# Altium project BRD4210C.PrjPcb
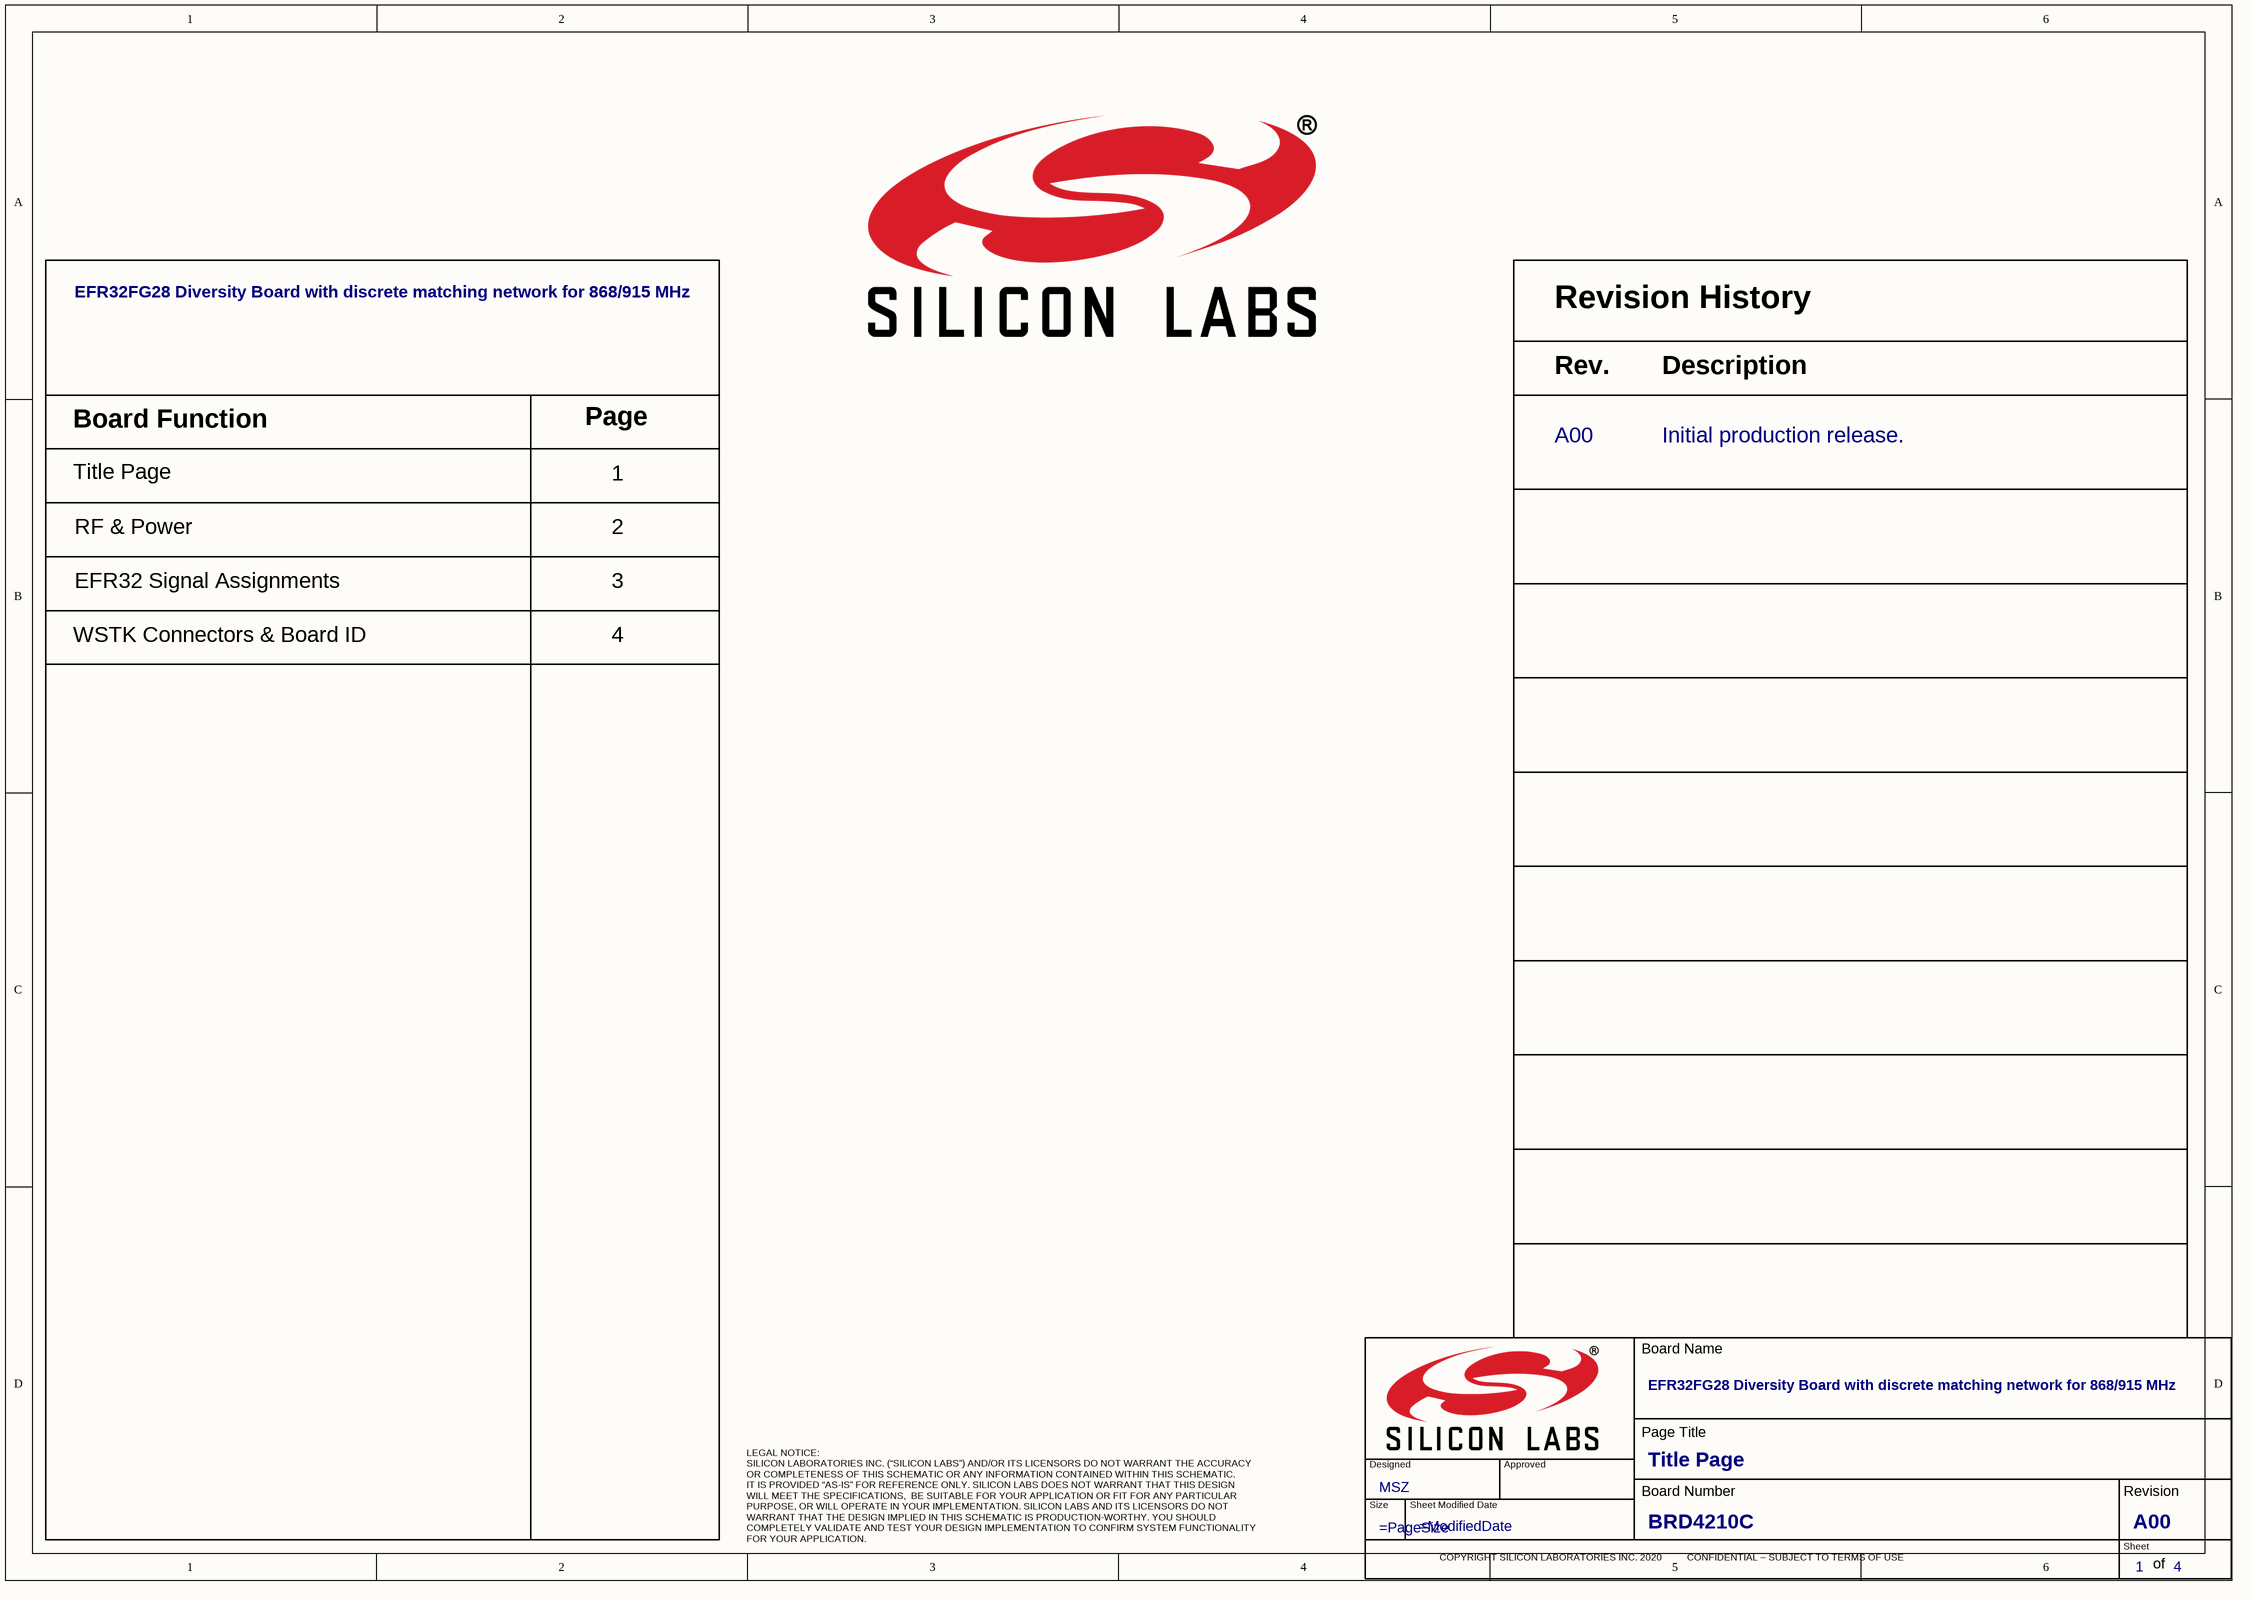
[diagram p0: 01_ Title Page.SchDoc]
4 sheets, 104 parts. Net scope: global (net labels, ports and power ports of the same name join across sheets).
Board file: PCB4210B_A00.PcbDoc
Sheets:
  01_ Title Page.SchDoc
  02_ RF & Power.SchDoc
  03_ EFR32 Signal Assignments.SchDoc
  04_ WSTK Connectors & Board ID.SchDoc

## Sheet 01_ Title Page.SchDoc: EFR32FG28 Diversity Board with discrete matching network for 868/915 MHz
size 420 x 297 mm; Rev3: 3; Dscr4A: g; Dscr8A: o; Dscr6A: k; Board Designer: MSZ; Dscr9A: q; RevCode: A00; Rev1: A00; Dscr3A: e; Header A: EFR32FG28 Diversity Board with discrete matching network for 868/915 MHz; Dscr9B: r; Rev8: 8; Rev5: 5; Page Number: 1; Page Size: A3; Rev6: 6; Page Count: 4; Rev9: 9; Dscr1A: Initial production release.; Doc: BRD4210C; OrgName: Silicon Labs; Dscr5B: j; Dscr7B: n; Rev7: 7; Dscr6B: l; Dscr2A: Updated U1 OPN.; Dscr7A: m; Rev4: 4; Dscr4B: h; Rev2: A00; Dscr3B: f; Dscr1B: b; Dscr8B: p; Page Title: Title Page; Dscr5A: i; Dscr2B: d; DsnPath: C:\Users\maszvobo\Downloads\BRD4210A-A01-schematic-dsn\BRD4210A.DSN; SchematicName: SCHEMATIC1; PageName: 01: Title Page; PageSize: A3; TopSchematic: True

### Parts
(Parts that share a designator on the sheet are numbered #1, #2 ... from top to bottom, then left to right.)
*#1  Header A: EFR32FG28 Diversity Board with discrete matching network for 868/915 MHz  (graphical)
*#2  Dscr1A: Initial production release.  Rev1: A00  (graphical)
*#3  Doc: BRD4210C  RevCode: A00  Board Designer: MSZ  Page Title: Title Page  Page Number: 1  Page Count: 4  Title: EFR32FG28 Diversity Board with discrete matching network for 868/915 MHz  (graphical)

### Notes on the sheet
- Board Function
- Page
- Title Page
- 1
- RF & Power
- EFR32 Signal Assignments
- 2
- 3
- WSTK Connectors & Board ID
- 4
- LEGAL NOTICE:
  SILICON LABORATORIES INC. (“SILICON LABS”) AND/OR ITS LICENSORS DO NOT WARRANT THE ACCURACY
  OR COMPLETENESS OF THIS SCHEMATIC OR ANY INFORMATION CONTAINED WITHIN THIS SCHEMATIC.
  IT IS PROVIDED “AS-IS” FOR REFERENCE ONLY. SILICON LABS DOES NOT WARRANT THAT THIS DESIGN
  WILL MEET THE SPECIFICATIONS,  BE SUITABLE FOR YOUR APPLICATION OR FIT FOR ANY PARTICULAR
  PURPOSE, OR WILL OPERATE IN YOUR IMPLEMENTATION. SILICON LABS AND ITS LICENSORS DO NOT
  WARRANT THAT THE DESIGN IMPLIED IN THIS SCHEMATIC IS PRODUCTION-WORTHY. YOU SHOULD
  COMPLETELY VALIDATE AND TEST YOUR DESIGN IMPLEMENTATION TO CONFIRM SYSTEM FUNCTIONALITY
  FOR YOUR APPLICATION.
- (in symbol Rev_History) Revision History; Rev.; Description
- (in symbol TitleBlock_SiliconLabs_A3) Board Name; Page Title; Designed; Approved; Board Number; Revision; Size; Sheet Modified Date; Sheet; COPYRIGHT SILICON LABORATORIES INC. 2020          CONFIDENTIAL – SUBJECT TO TERMS OF USE; of

### Library data of the parts
*#1 = Toc_Header
*#2 = Rev_History: Dscr4B: h; Dscr5B: j; Dscr4A: g; Dscr6B: l; Dscr5A: i; Dscr7B: n; Dscr6A: k; Dscr8B: p; Dscr7A: m; Dscr9B: r; Dscr8A: o; Dscr9A: q; Dscr1B: b; Dscr2B: d; Dscr3B: f; Dscr3A: e; Rev9: 9; Rev8: 8; Rev7: 7; Rev6: 6; Rev5: 5; Rev4: 4; Rev3: 3; RevCode: A00
*#3 = TitleBlock_SiliconLabs_A3: Page Size: =PageSize; Page Modify Date: =ModifiedDate; OrgName: Silicon Labs

## Sheet 02_ RF & Power.SchDoc: EFR32FG28 Diversity Board with discrete matching network for 868/915 MHz
size 420 x 297 mm; Doc: BRD4210C; OrgName: Silicon Labs; Page Number: 2; Page Title: RF & Power; Page Size: A3; Page Count: 4; Board Designer: MSZ; RevCode: A00; DsnPath: C:\Users\maszvobo\Downloads\BRD4210A-A01-schematic-dsn\BRD4210A.DSN; SchematicName: SCHEMATIC1; PageName: 02: RF & Power; PageSize: A3; TopSchematic: True
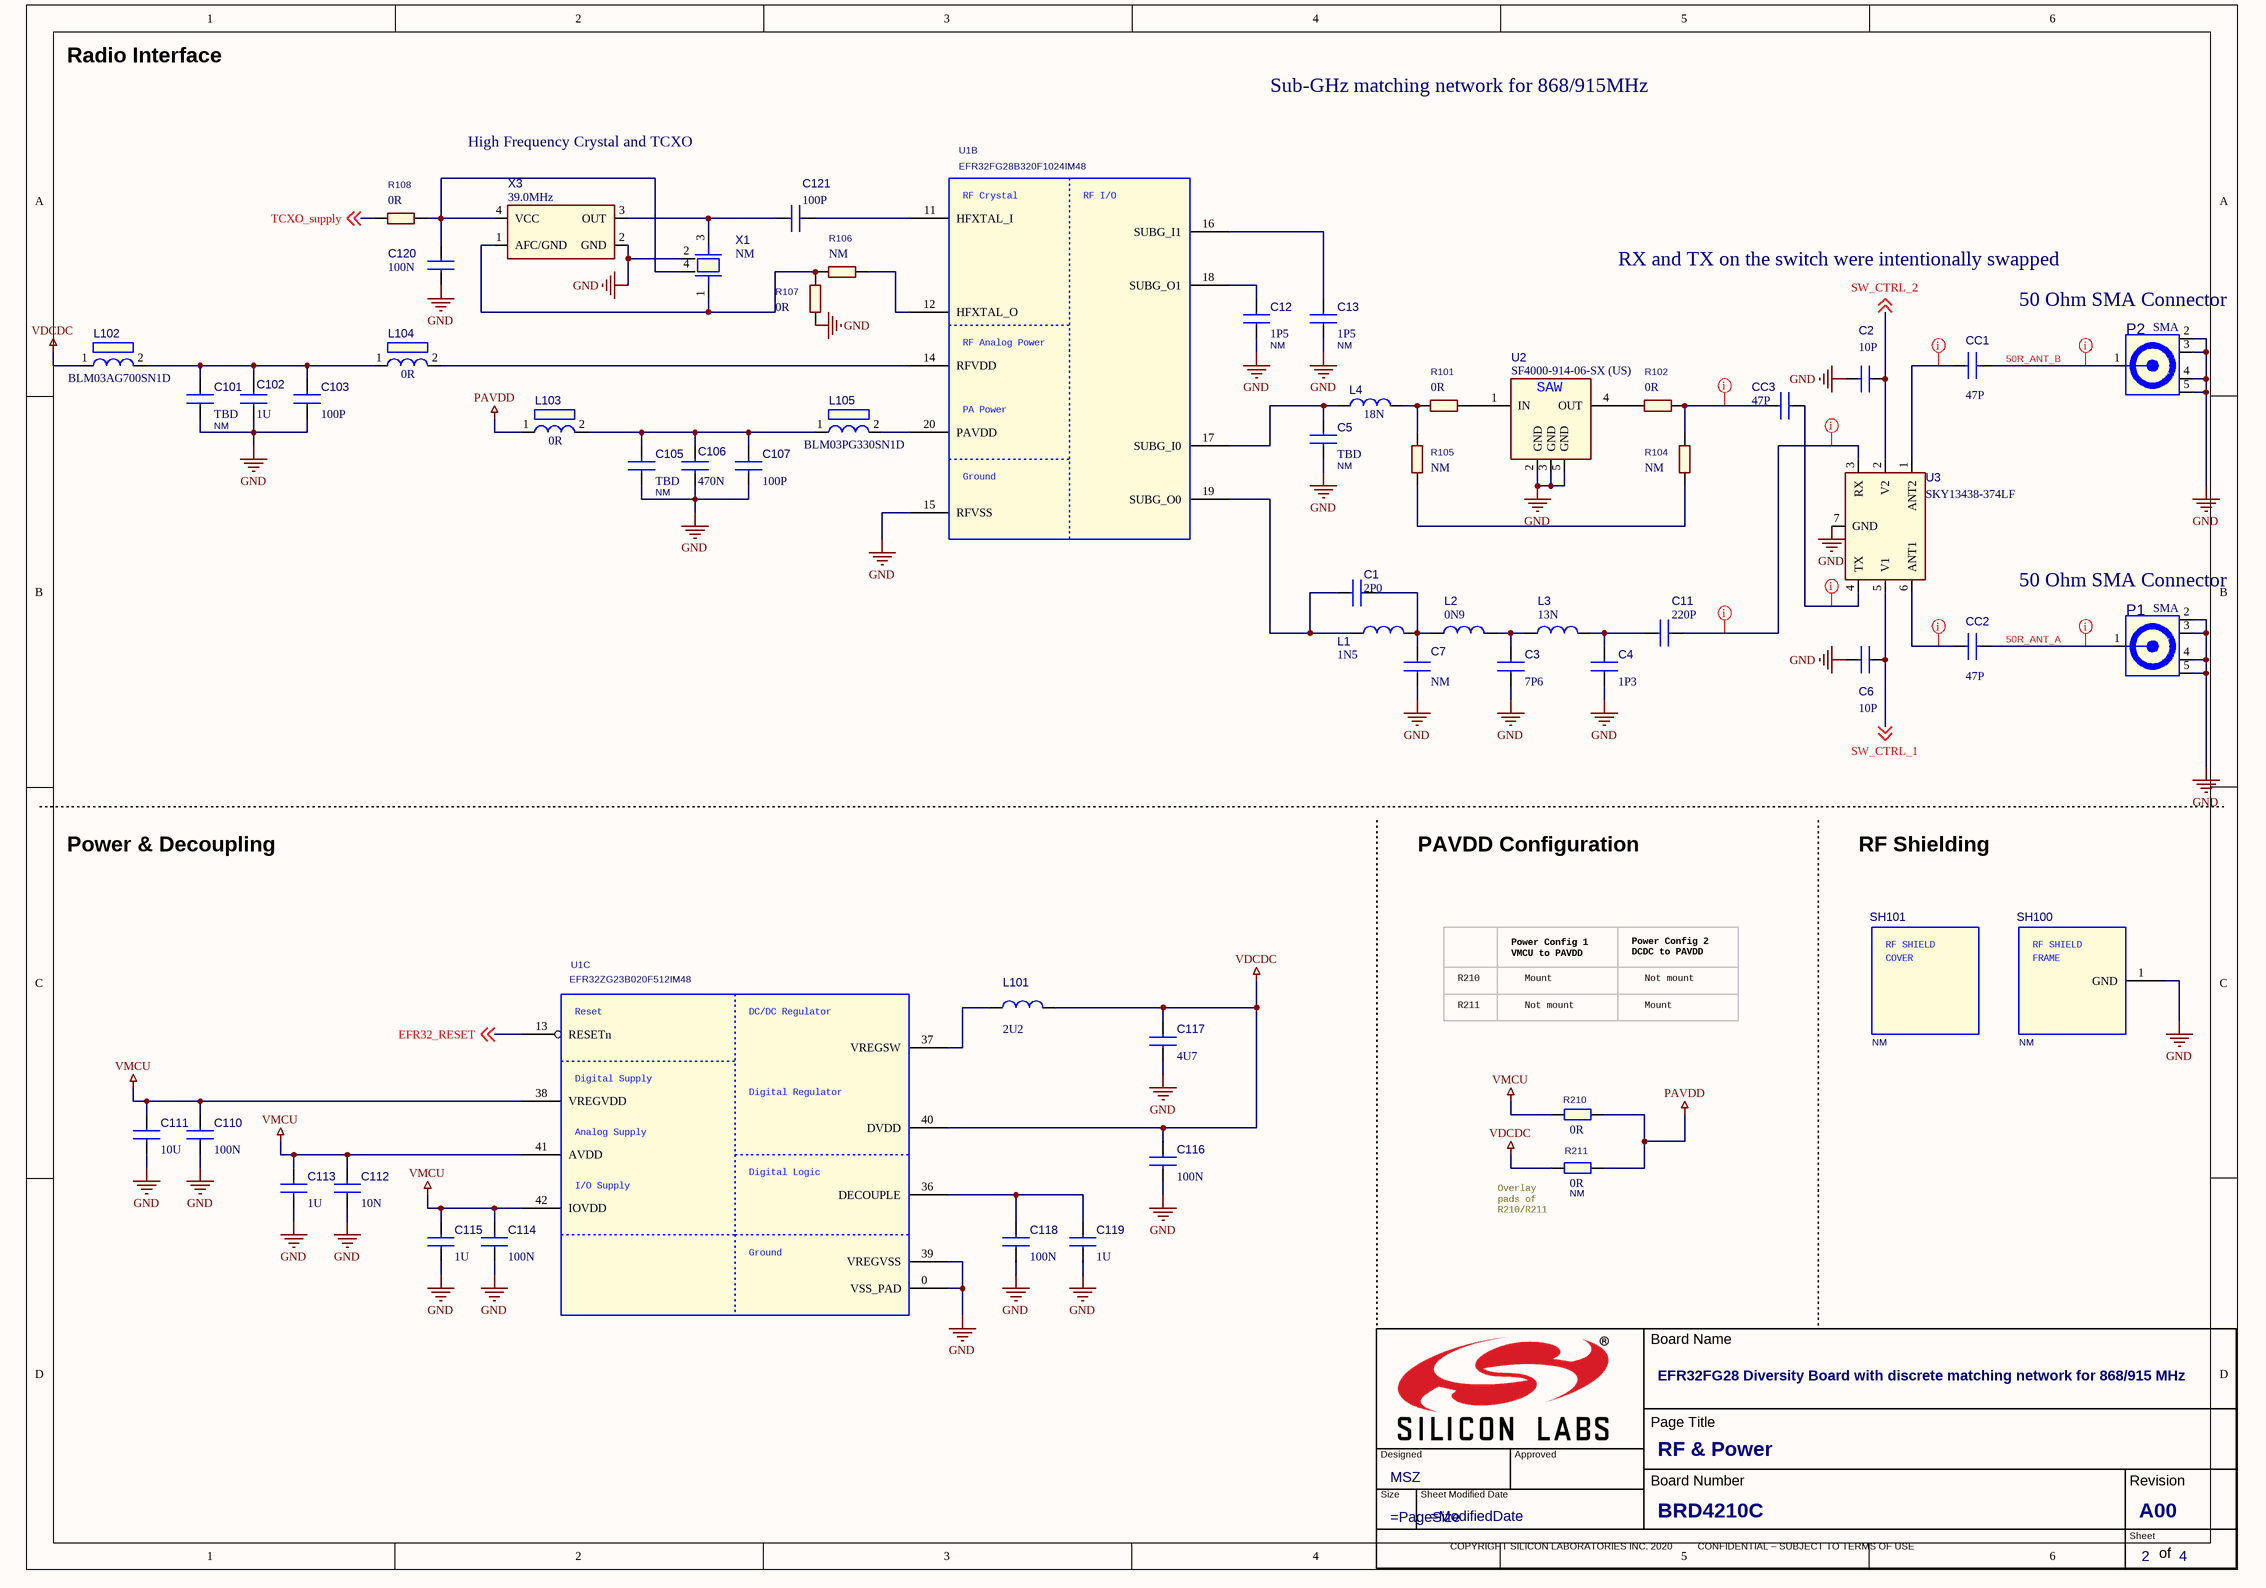
[diagram p1: 02_ RF & Power.SchDoc]

### Parts
(Parts that share a designator on the sheet are numbered #1, #2 ... from top to bottom, then left to right.)
*#4  Doc: BRD4210C  RevCode: A00  Board Designer: MSZ  Page Title: RF & Power  Page Number: 2  Page Count: 4  Title: EFR32FG28 Diversity Board with discrete matching network for 868/915 MHz  (graphical)
C1  2P0  [C0201_L]
C2  10P  [C0201_L]
C3  7P6  [C0201_L]
C4  1P3  [C0201_L]
C5  TBD  Not Mounted: NM  [C0201_L]
C6  10P  [C0201_L]
C7  NM  [C0201_L]
C11  220P  [C0201_L]
C12  1P5  Not Mounted: NM  [C0201_L]
C13  1P5  Not Mounted: NM  [C0201_L]
C101  TBD  Not Mounted: NM  [C0201_L]
C102  1U  [C0402_L]
C103  100P  [C0201_L]
C105  TBD  Not Mounted: NM  [C0201_L]
C106  470N  [C0402_L]
C107  100P  [C0201_L]
C110  100N  [C0201_L]
C111  10U  [C0603_L]
C112  10N  [C0201_L]
C113  1U  [C0402_L]
C114  100N  [C0201_L]
C115  1U  [C0402_L]
C116  100N  [C0201_L]
C117  4U7  [C0603_L]
C118  100N  [C0201_L]
C119  1U  [C0402_L]
C120  100N  [C0201_L]
C121  100P  [C0201_L]
CC1  47P  [C0201_L]
CC2  47P  [C0201_L]
CC3  47P  [C0201_L]
L1  1N5  [COIL_0201_L]
L2  0N9  [COIL_0201_L]
L3  13N  [COIL_0201_L]
L4  18N  [COIL_0201_L]
L101  2U2  [COIL_1008_L]
L102  BLM03AG700SN1D  [COIL_MUR_BLM03_0201]
L103  0R  [COIL_MUR_BLM03_0201]
L104  0R  [COIL_MUR_BLM03_0201]
L105  BLM03PG330SN1D  [COIL_MUR_BLM03_0201]
P1  SMA  [TE_SMA_1814832_TH_VER]
P2  SMA  [TE_SMA_1814832_TH_VER]
R101  0R  [R0201_L]
R102  0R  [R0201_L]
R104  NM  [R0201_L]
R105  NM  [R0201_L]
R106  NM  [R0201_L]
R107  0R  [R0201_L]
R108  0R  [R0201_L]
R210  0R  [R0402_L]
R211  0R  Not Mounted: NM  [R0402_L]
SH100  Not Mounted: NM  [Shield_21x21mm]  (hidden comment: RF_SHIELD_FRAME_36103205S)
SH101  Not Mounted: NM  (hidden comment: RF_SHIELD_COVER_36003200S)
U1  EFR32FG28B320F1024IM48  [QFN48_M040_6.0X6.0_EP_SL]  (parts B,C of 3)
U2  SF4000-914-06-SX (US)  [SF1256]
U3  SKY13438-374LF  [SKY13438-374LF]
X1  NM  [X_SSS_DSX211SH_2.05X1.65-4]
X3  39.0MHz  [TCXO_7Z-38.400MBG-T_SMD2016_TXC]

### Nets
GND: C2.1 C3.2 C4.2 C5.2 C6.1 C7.2 C12.2 C13.2 C101.2 C102.2 C103.2 C105.2 C106.2 C107.2 C110.2 C111.2 C112.2 C113.2 C114.2 C115.2 C116.2 C117.2 C118.2 C119.2 C120.2 P1.2(GND1) P1.3(GND2) P1.4(GND3) P1.5(GND4) P2.2(GND1) P2.3(GND2) P2.4(GND3) P2.5(GND4) R107.2 SH100.1(GND) U1.0(VSS_PAD) U1.15(RFVSS) U1.39(VREGVSS) U2.2(GND) U2.3(GND) U2.5(GND) U3.7(GND) X1.2 X3.2(GND)
PAVDD: L103.1 R210.1 R211.2
VDCDC: C116.1 C117.1 L101.2 L102.1 R211.1 U1.40(DVDD)
VMCU: C110.1 C111.1 C112.1 C113.1 C114.1 C115.1 R210.2 U1.38(VREGVDD) U1.41(AVDD) U1.42(IOVDD)
50R_ANT_A: CC2.2 P1.1(SIGNAL)
50R_ANT_B: CC1.2 P2.1(SIGNAL)
EFR32_RESET: U1.13(RESETn) ; off-sheet EFR32_RESET  [project net DBG_RESET]
SW_CTRL_1: C6.2 U3.5(V1) ; off-sheet SW_CTRL_1  [project net EFR32_PB3]
SW_CTRL_2: C2.2 U3.2(V2) ; off-sheet SW_CTRL_2  [project net EFR32_PD3]
TCXO_supply: R108.1 ; off-sheet TCXO_supply
NetC1_1: C1.1 L1.1 U1.19(SUBG_O0)
NetC1_2: C1.2 C7.1 L1.2 L2.1
NetC3_1: C3.1 L2.2 L3.1
NetC4_1: C4.1 C11.1 L3.2
NetC5_1: C5.1 L4.1 U1.17(SUBG_I0)
NetC11_2: C11.2 U3.3(RX)
NetC12_1: C12.1 U1.18(SUBG_O1)
NetC13_1: C13.1 U1.16(SUBG_I1)
NetC101_1: C101.1 C102.1 C103.1 L102.2 L104.1
NetC105_1: C105.1 C106.1 C107.1 L103.2 L105.1
NetC118_1: C118.1 C119.1 U1.36(DECOUPLE)
NetC120_1: C120.1 R108.2 X1.4 X3.4(VCC)
NetC121_1: C121.1 X1.3 X3.3(OUT)
NetC121_2: C121.2 U1.11(HFXTAL_I)
NetCC1_1: CC1.1 U3.1(ANT2)
NetCC2_1: CC2.1 U3.6(ANT1)
NetCC3_1: CC3.1 R102.2 R104.1
NetCC3_2: CC3.2 U3.4(TX)
NetL4_2: L4.2 R101.1 R105.1
NetL101_1: L101.1 U1.37(VREGSW)
NetL104_2: L104.2 U1.14(RFVDD)
NetL105_2: L105.2 U1.20(PAVDD)
NetR101_2: R101.2 U2.1(IN)
NetR102_1: R102.1 U2.4(OUT)
NetR104_2: R104.2 R105.2
NetR106_1: R106.1 R107.1 X1.1 X3.1(AFC/GND)
NetR106_2: R106.2 U1.12(HFXTAL_O)

### Layout directives
net class 50Ohm: 50R_ANT_A, 50R_ANT_B, NetC11_2, NetCC1_1, NetCC2_1, NetCC3_1, NetCC3_2

### Notes on the sheet
- Radio Interface
- Sub-GHz matching network for 868/915MHz
- High Frequency Crystal and TCXO
- RX and TX on the switch were intentionally swapped
- (near P2) 50 Ohm SMA Connector
- (near P1) 50 Ohm SMA Connector
- Power & Decoupling
- PAVDD Configuration
- RF Shielding
- R210
- Power Config 1
  VMCU to PAVDD
- Mount
- Power Config 2
  DCDC to PAVDD
- Not mount
- R211
- (near R211) Overlay
  pads of
  R210/R211
- (in symbol EFR32xG23_QFN48, part B) RF Crystal; RF I/O; RF Analog Power; PA Power; Ground
- (in symbol EFR32xG23_QFN48, part C) Reset; DC/DC Regulator; Digital Supply; Digital Regulator; Analog Supply; Digital Logic; I/O Supply; Ground
- (in symbol RF_SHIELD_COVER_36003200S) RF SHIELD; COVER
- (in symbol RF_SHIELD_FRAME_36103205S) RF SHIELD; FRAME
- (in symbol SF4000-914-06-SX) SAW
- (in symbol TitleBlock_SiliconLabs_A3) Board Name; Page Title; Designed; Approved; Board Number; Revision; Size; Sheet Modified Date; Sheet; COPYRIGHT SILICON LABORATORIES INC. 2020          CONFIDENTIAL – SUBJECT TO TERMS OF USE; of

### Library data of the parts
*#4 = TitleBlock_SiliconLabs_A3: Page Size: =PageSize; Page Modify Date: =ModifiedDate; OrgName: Silicon Labs
C1 = C0201: Part Reference: C1; Mfg #: GRM0335C1H1R9BA01D; Mfg: Murata; Tolerance: ±0.1pF; Value: 1P9; Technology: C0G; PCB Footprint: C0201_L
C2 C6 CC1-CC3 = C0201: Part Reference: CC11; Tolerance: ±2%; Mfg: Murata; Mfg #: GJM0335C1E180GB01D; Technology: C0G; PCB Footprint: C0201_L
  C2 C6: Value: 10P
  CC1-CC3: Value: 47P
C3 = C0201: Part Reference: C3; Mfg #: GRM0335C1H7R2BA01D; Mfg: Murata; Tolerance: ±0.1pF; Value: 7P2; Technology: C0G; PCB Footprint: C0201_L
C4 = C0201: Part Reference: C4; Mfg #: GRM0335C1H1R3BA01D; Mfg: Murata; Tolerance: ±0.1pF; Technology: C0G; Value: 1P3; PCB Footprint: C0201_L
C5 = C0201: Part Reference: C5; Value: TBD; PCB Footprint: C0201_L
C7 = C0201: Part Reference: C1; Mfg #: GRM0335C1H1R9BA01D; Mfg: Murata; Tolerance: ±0.1pF; Technology: C0G; Value: NM; PCB Footprint: C0201_L
C11 = C0201: Part Reference: C11; Mfg #: GRM0335C1H221GA01D; Mfg: Murata; Tolerance: ±2%; Technology: C0G; Value: 220P; PCB Footprint: C0201_L
C12 = C0201: Part Reference: C12; Mfg #: GRM0335C1E1R5WA01D; Mfg: Murata; Tolerance: ±0.05pF; Technology: C0G; Value: 1P5; PCB Footprint: C0201_L
C13 C120 C121 = C0201: Part Reference: C13; Mfg #: GRM0335C1E1R5WA01D; Mfg: Murata; Tolerance: ±0.05pF; Technology: C0G; PCB Footprint: C0201_L
  C13: Value: 1P5
  C120: Value: 100N
  C121: Value: 100P
C101 = C0201: Part Reference: C101; Tolerance: +/-0.05P; Rating: 50V; Technology: C0G; Value: TBD; PCB Footprint: C0201_L
C102 = C0402: Part Reference: C102; Tolerance: 10%; Rating: 6.3V; Technology: X7R; Value: 1U; PCB Footprint: C0402_L
C103 = C0201: Part Reference: C103; Tolerance: 5%; Rating: 25V; Technology: C0G; Value: 100P; PCB Footprint: C0201_L
C105 = C0201: Part Reference: C105; Tolerance: +/-0.05P; Rating: 50V; Technology: C0G; Value: TBD; PCB Footprint: C0201_L
C106 = C0402: Part Reference: C106; Tolerance: 10%; Rating: 10V; Technology: X7R; Value: 470N; PCB Footprint: C0402_L
C107 = C0201: Part Reference: C107; Tolerance: 5%; Rating: 25V; Technology: C0G; Value: 100P; PCB Footprint: C0201_L
C110 = C0201: Part Reference: C110; Tolerance: 20%; Rating: 16V; Technology: X7S; Value: 100N; PCB Footprint: C0201_L
C111 = C0603: Part Reference: C111; Tolerance: 10%; Rating: 25V; Technology: X5R; Value: 10U; PCB Footprint: C0603_L
C112 = C0201: Part Reference: C112; Tolerance: 10%; Rating: 16V; Technology: X7S; Value: 10N; PCB Footprint: C0201_L
C113 = C0402: Part Reference: C113; Tolerance: 10%; Rating: 6.3V; Technology: X7R; Value: 1U; PCB Footprint: C0402_L
C114 = C0201: Part Reference: C114; Tolerance: 20%; Rating: 16V; Technology: X7S; Value: 100N; PCB Footprint: C0201_L
C115 = C0402: Part Reference: C115; Tolerance: 10%; Rating: 6.3V; Technology: X7R; Value: 1U; PCB Footprint: C0402_L
C116 = C0201: Part Reference: C116; Tolerance: 20%; Rating: 16V; Technology: X7S; Value: 100N; PCB Footprint: C0201_L
C117 = C0603: Part Reference: C117; Tolerance: 10%; Rating: 6.3V; Technology: X7R; Value: 4U7; PCB Footprint: C0603_L
C118 = C0201: Part Reference: C118; Tolerance: 20%; Rating: 16V; Technology: X7S; Value: 100N; PCB Footprint: C0201_L
C119 = C0402: Part Reference: C119; Tolerance: 10%; Rating: 6.3V; Technology: X7R; Value: 1U; PCB Footprint: C0402_L
L1 = L0201: Part Reference: L1; Mfg: Murata; Mfg #: LQP03HQ1N5W02D; Tolerance: ±0.05nH; Value: 1N5; PCB Footprint: COIL_0201_L
L2 = L0201: Part Reference: L2; Mfg: Murata; Mfg #: LQP03HQ1N3W02D; Tolerance: ±0.05nH; Value: 1N3; PCB Footprint: COIL_0201_L
L3 = L0201: Part Reference: L3; Mfg: Murata; Mfg #: LQP03HQ13NH02D; Tolerance: ±3%; Value: 13N; PCB Footprint: COIL_0201_L
L4 = L0201: Part Reference: L4; Mfg: Murata; Mfg #: LQP03HQ18NH02D; Tolerance: ±3%; Value: 18N; PCB Footprint: COIL_0201_L
L101 = L1008: Part Reference: L101; Tolerance: +/-20%; Mfg #: DFE2HCAH2R2MJ0L; Mfg: Murata; Value: 2U2; PCB Footprint: COIL_1008_L
L102 = BLM03AX: Part Reference: L102; Mfg: Murata; Mfg #: BLM03AG700SN1D; Price_1K: 0.05; Value: BLM03AG700SN1D; PCB Footprint: COIL_MUR_BLM03_0201
L103 = BLM03AX: Part Reference: L103; Price_1K: 0.05; Value: 0R; PCB Footprint: COIL_MUR_BLM03_0201
L104 = BLM03AX: Part Reference: L104; Price_1K: 0.05; Value: 0R; PCB Footprint: COIL_MUR_BLM03_0201
L105 = BLM03AX: Part Reference: L105; Mfg: Murata; Mfg #: BLM03PG330SN1D; Price_1K: 0.05; Value: BLM03PG330SN1D; PCB Footprint: COIL_MUR_BLM03_0201
P1 P2 = SMA_TH_WELLSHOW: Part Reference: P1; Mfg #: C02AN31P00101; Price_1K: 1.46; Mfg: Wellshow; Value: SMA; PCB Footprint: TE_SMA_1814832_TH_VER
R101 R102 R106-R108 = R0201: Price_1K: 0.005
  R101 R102 R107 R108: Value: 0R
  R106: Value: NM
R104 R105 = R0201: Not Mounted: NM; Price_1K: 0.005; Value: NM
R210 = R0402: Part Reference: R210; Price_1K: 0.005; Value: 0R; PCB Footprint: R0402_L
R211 = R0402: Part Reference: R211; Price_1K: 0.005; Value: 0R; PCB Footprint: R0402_L
SH100 = RF_SHIELD_FRAME_36103205S: Part Reference: SH100; Mfg: Würth Elektronik; Mfg #: 36103205S; Price_1k: 1.00; Value: RF_SHIELD_FRAME_36103205S; PCB Footprint: Shield_21x21mm
SH101 = RF_SHIELD_COVER_36003200S: Part Reference: SH101; Mfg: Würth Elektronik; Mfg #: 36003200S; Price_1k: 0.944; Value: RF_SHIELD_COVER_36003200S
U1 = EFR32xG23_QFN48: Part Reference: U1; MFG: Silicon Labs; MFG #: EFR32ZG23B020F512IM48-CR; Value: EFR32FG28B320F1024IM48; PCB Footprint: QFN48_M040_6.0X6.0_EP_SL
U2 = SF4000-914-06-SX: B2645 from Qualcomm also fits; Mfg: ACTE; Mfg #: SF4000-914-06-SX; Value: SF4000-914-06-SX (US)
U3 = SKY13438-374LF: Mfg #: BGS12WN6E6327XTSA1; Mfg: Infineon; Value: SKY13438-374LF
X1 = DSX211SH: Part Reference: X1; Mfg #: TZ3541C; Mfg: Tai-Saw; Value: 39.000 MHz; PCB Footprint: KDS_DSX211SH_2016; Price_1K: 0.512
X3 = 7Z-38.400MBG-T: Part Reference: X1; Mfg: TXC; Mfg #: 7Z-38.400MBG-T

## Sheet 03_ EFR32 Signal Assignments.SchDoc: EFR32FG28 Diversity Board with discrete matching network for 868/915 MHz
size 420 x 297 mm; Doc: BRD4210C; OrgName: Silicon Labs; Page Number: 3; Page Title: EFR32 Signal Assignments; Page Size: A3; Page Count: 4; Board Designer: MSZ; RevCode: A00; DsnPath: C:\Users\maszvobo\Downloads\BRD4210A-A01-schematic-dsn\BRD4210A.DSN; SchematicName: SCHEMATIC1; PageName: 03: EFR32 Signal Assignments; PageSize: A3; TopSchematic: True
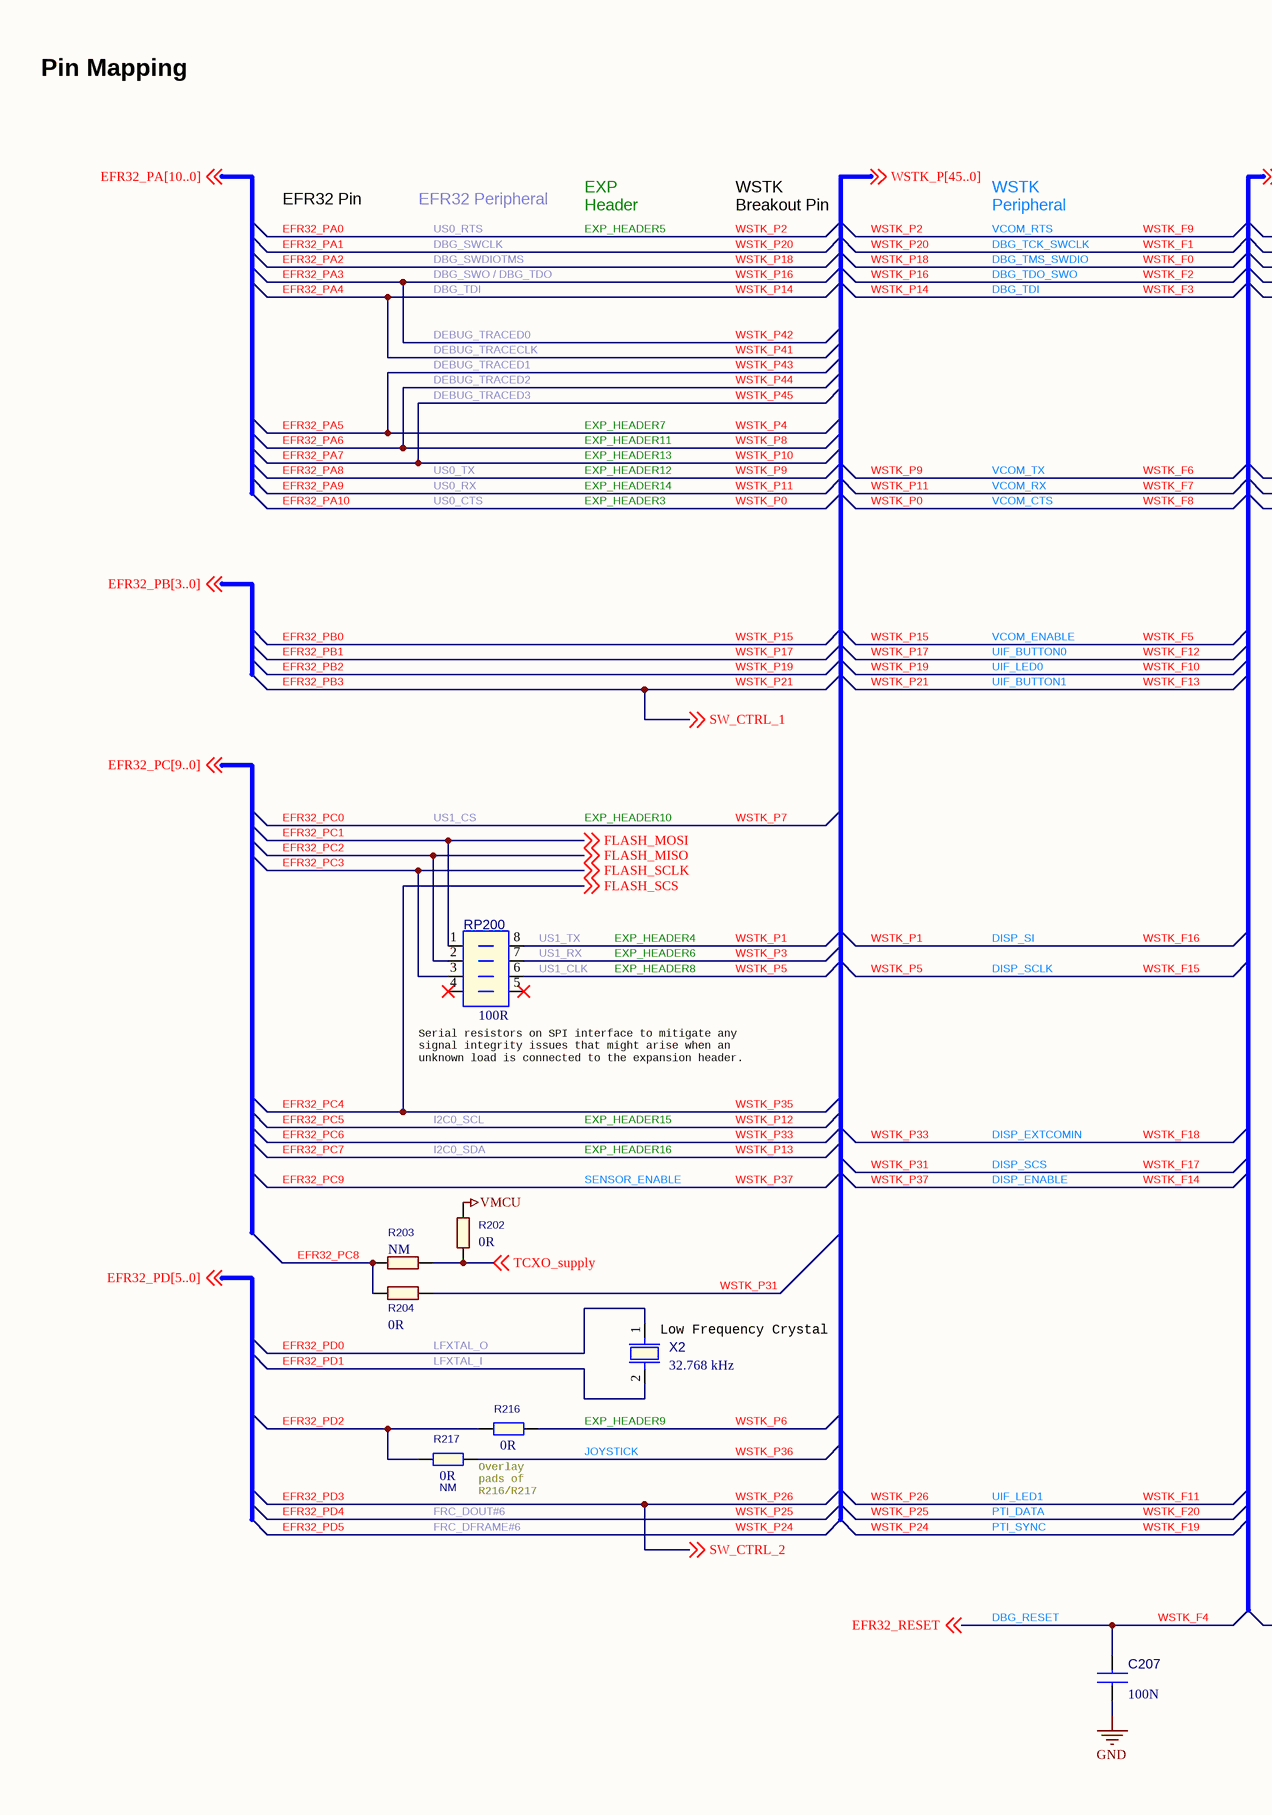
[diagram p2: 03_ EFR32 Signal Assignments.SchDoc, left]
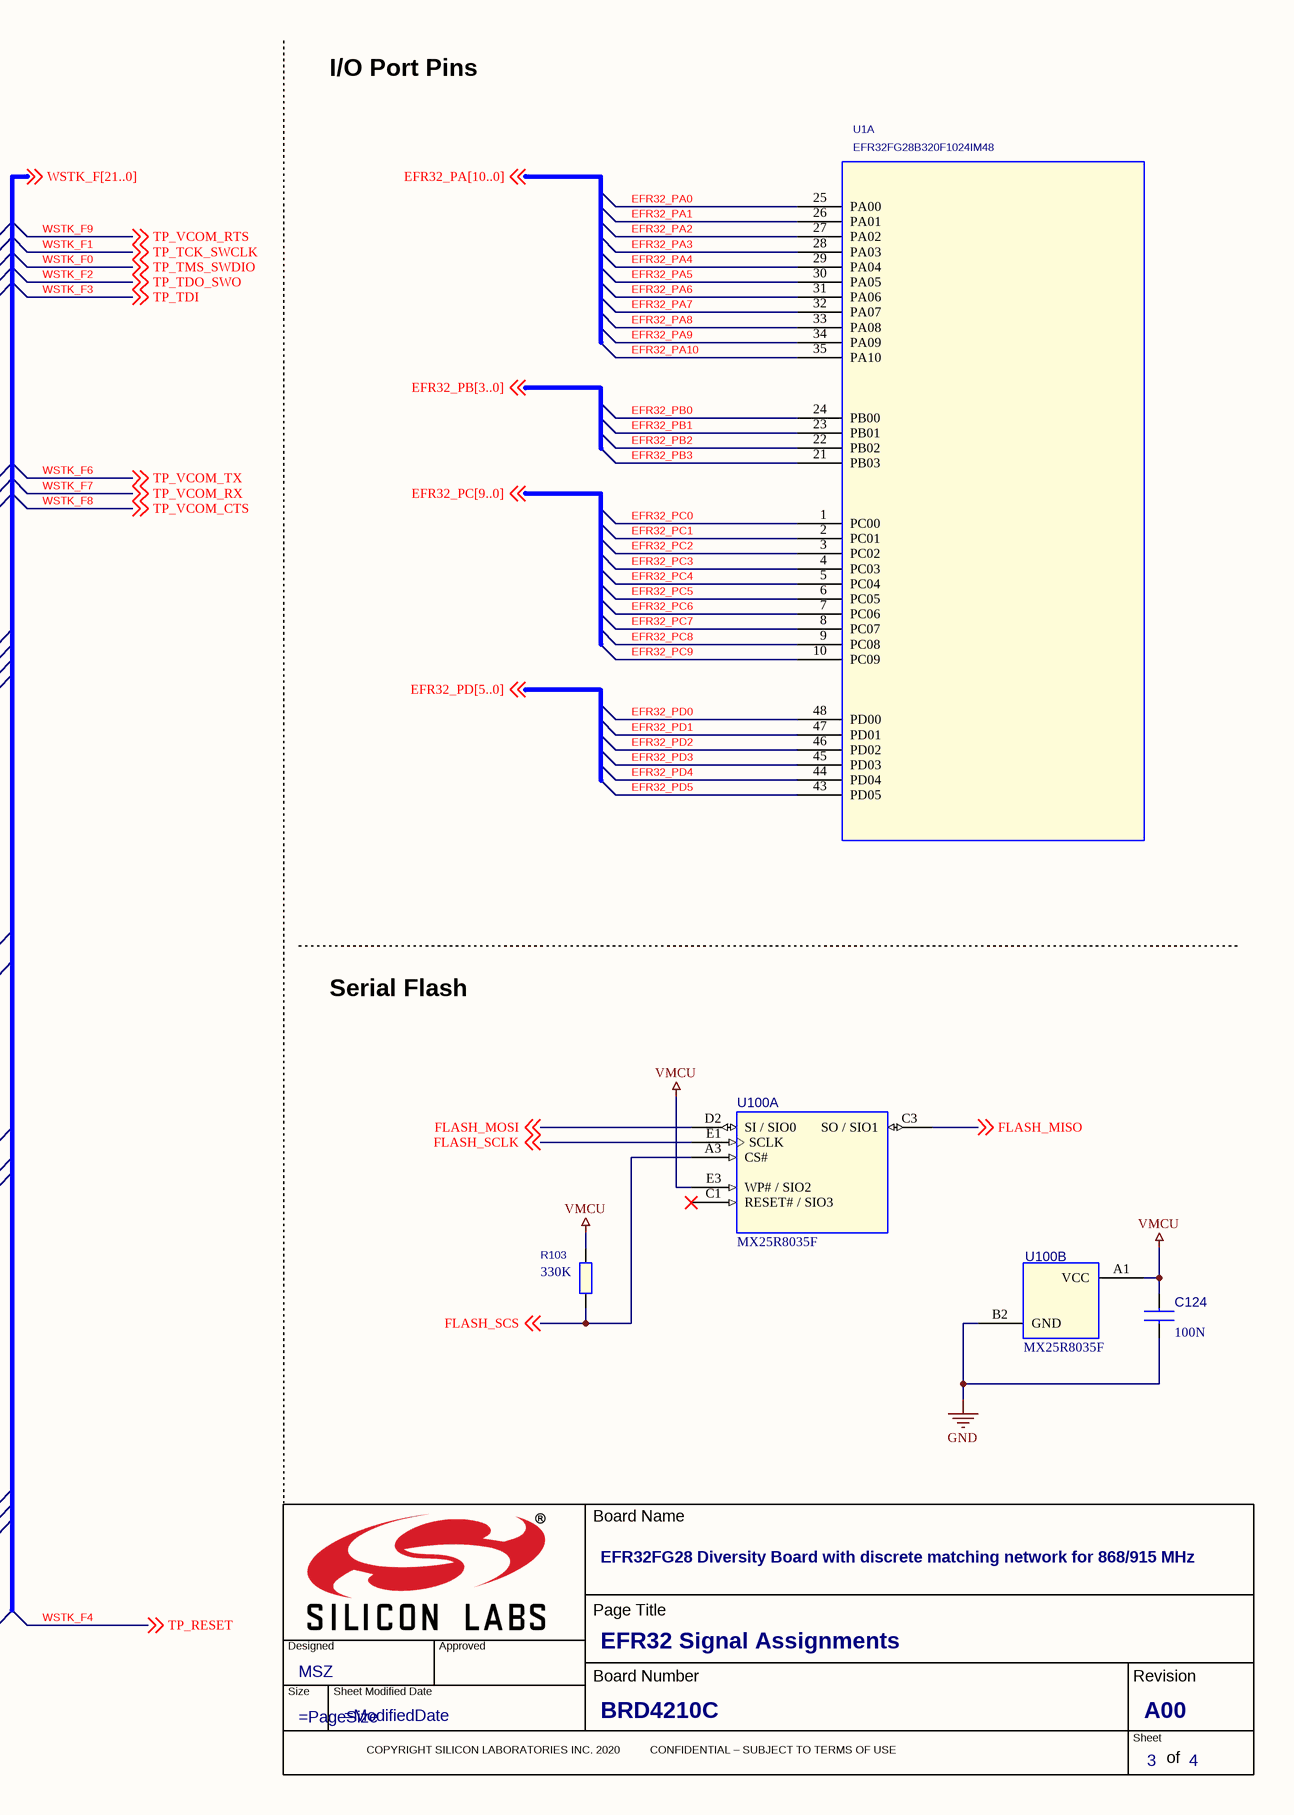
[diagram p3: 03_ EFR32 Signal Assignments.SchDoc, right]

### Parts
(Parts that share a designator on the sheet are numbered #1, #2 ... from top to bottom, then left to right.)
*#5  Doc: BRD4210C  RevCode: A00  Board Designer: MSZ  Page Title: EFR32 Signal Assignments  Page Number: 3  Page Count: 4  Title: EFR32FG28 Diversity Board with discrete matching network for 868/915 MHz  (graphical)
C124  100N  [C0201_L]
C207  100N  [C0201_L]
R103  330K  [R0201_L]
R202  0R  [R0201_L]
R203  NM  [R0201_L]
R204  0R  [R0201_L]
R216  0R  [R0402_L]
R217  0R  Not Mounted: NM  [R0402_L]
RP200  100R  [RES_MNR04-8]
U1  EFR32FG28B320F1024IM48  [QFN48_M040_6.0X6.0_EP_SL]  (part A of 3)
U100  MX25R8035F  [BGA8_M040_1.24x1.75_WLCSP]  (parts A,B of 2)
X2  32.768 kHz  [X_MCS_CM8V-T1A]

### Nets
GND: C124.2 C207.2 U100.B2(GND)
VMCU: C124.1 R103.2 R202.2 U100.A1(VCC) U100.E3(WP#_/_SIO2)
DBG_RESET: C207.1 ; off-sheet EFR32_RESET, off-sheet TP_RESET  [also labelled EFR32_RESET, TP_RESET, WSTK_F4]
DBG_SWCLK: U1.26(PA01) ; off-sheet TP_TCK_SWCLK  [also labelled DBG_TCK_SWCLK, EFR32_PA1, TP_TCK_SWCLK, WSTK_F1, WSTK_P20]
DBG_SWDIOTMS: U1.27(PA02) ; off-sheet TP_TMS_SWDIO  [also labelled DBG_TMS_SWDIO, EFR32_PA2, TP_TMS_SWDIO, WSTK_F0, WSTK_P18]
DBG_SWO / DBG_TDO: U1.28(PA03) ; off-sheet TP_TDO_SWO  [also labelled DBG_TDO_SWO, DEBUG_TRACED0, EFR32_PA3, TP_TDO_SWO, WSTK_F2, WSTK_P16, WSTK_P42]
DBG_TDI: U1.29(PA04) ; off-sheet TP_TDI  [also labelled DEBUG_TRACECLK, EFR32_PA4, TP_TDI, WSTK_F3, WSTK_P14, WSTK_P41]
DEBUG_TRACED1: U1.30(PA05)  [also labelled EFR32_PA5, EXP_HEADER7, WSTK_P4, WSTK_P43]
DEBUG_TRACED2: U1.31(PA06)  [also labelled EFR32_PA6, EXP_HEADER11, WSTK_P44, WSTK_P8]
DEBUG_TRACED3: U1.32(PA07)  [also labelled EFR32_PA7, EXP_HEADER13, WSTK_P10, WSTK_P45]
DISP_ENABLE: U1.10(PC09)  [also labelled EFR32_PC9, SENSOR_ENABLE, WSTK_F14, WSTK_P37]
DISP_EXTCOMIN: U1.7(PC06)  [also labelled EFR32_PC6, WSTK_F18, WSTK_P33]
DISP_SCLK: RP200.6(R16)  [also labelled EXP_HEADER8, US1_CLK, WSTK_F15, WSTK_P5]
DISP_SCS: R204.1  [also labelled WSTK_F17, WSTK_P31]
DISP_SI: RP200.8(R18)  [also labelled EXP_HEADER4, US1_TX, WSTK_F16, WSTK_P1]
EFR32_PA0: U1.25(PA00) ; off-sheet TP_VCOM_RTS  [also labelled EXP_HEADER5, TP_VCOM_RTS, US0_RTS, VCOM_RTS, WSTK_F9, WSTK_P2]
EFR32_PA8: U1.33(PA08) ; off-sheet TP_VCOM_TX  [also labelled EXP_HEADER12, TP_VCOM_TX, US0_TX, VCOM_TX, WSTK_F6, WSTK_P9]
EFR32_PA9: U1.34(PA09) ; off-sheet TP_VCOM_RX  [also labelled EXP_HEADER14, TP_VCOM_RX, US0_RX, VCOM_RX, WSTK_F7, WSTK_P11]
EFR32_PA10: U1.35(PA10) ; off-sheet TP_VCOM_CTS  [also labelled EXP_HEADER3, TP_VCOM_CTS, US0_CTS, VCOM_CTS, WSTK_F8, WSTK_P0]
EFR32_PB0: U1.24(PB00)  [also labelled VCOM_ENABLE, WSTK_F5, WSTK_P15]
EFR32_PB1: U1.23(PB01)  [also labelled UIF_BUTTON0, WSTK_F12, WSTK_P17]
EFR32_PB2: U1.22(PB02)  [also labelled UIF_LED0, WSTK_F10, WSTK_P19]
EFR32_PB3: U1.21(PB03) ; off-sheet SW_CTRL_1  [also labelled SW_CTRL_1, UIF_BUTTON1, WSTK_F13, WSTK_P21]
EFR32_PC0: U1.1(PC00)  [also labelled EXP_HEADER10, US1_CS, WSTK_P7]
EFR32_PC1: RP200.1(R11) U1.2(PC01) U100.D2(SI_/_SIO0) ; off-sheet FLASH_MOSI  [also labelled FLASH_MOSI]
EFR32_PC2: RP200.2(R12) U1.3(PC02) U100.C3(SO_/_SIO1) ; off-sheet FLASH_MISO  [also labelled FLASH_MISO]
EFR32_PC3: RP200.3(R13) U1.4(PC03) U100.E1(SCLK) ; off-sheet FLASH_SCLK  [also labelled FLASH_SCLK]
EFR32_PC4: R103.1 U1.5(PC04) U100.A3(CS#) ; off-sheet FLASH_SCS  [also labelled FLASH_SCS, WSTK_P35]
EFR32_PC5: U1.6(PC05)  [also labelled EXP_HEADER15, I2C0_SCL, WSTK_P12]
EFR32_PC7: U1.8(PC07)  [also labelled EXP_HEADER16, I2C0_SDA, WSTK_P13]
EFR32_PC8: R203.2 R204.2 U1.9(PC08)
EFR32_PD0: U1.48(PD00) X2.1  [also labelled LFXTAL_O]
EFR32_PD1: U1.47(PD01) X2.2  [also labelled LFXTAL_I]
EFR32_PD2: R216.1 R217.1 U1.46(PD02)
EFR32_PD3: U1.45(PD03) ; off-sheet SW_CTRL_2  [also labelled SW_CTRL_2, UIF_LED1, WSTK_F11, WSTK_P26]
EFR32_PD4: U1.44(PD04)  [also labelled FRC_DOUT#6, PTI_DATA, WSTK_F20, WSTK_P25]
EFR32_PD5: U1.43(PD05)  [also labelled FRC_DFRAME#6, PTI_SYNC, WSTK_F19, WSTK_P24]
EXP_HEADER6: RP200.7(R17)  [also labelled US1_RX, WSTK_P3]
EXP_HEADER9: R216.2  [also labelled WSTK_P6]
JOYSTICK: R217.2  [also labelled WSTK_P36]
TCXO_supply: R202.1 R203.1 ; off-sheet TCXO_supply

Not connected (* = marked no-connect by the designer): RP200 4(R14)* 5(R15)*; U100 C1(RESET#_/_SIO3)*

### Notes on the sheet
- Pin Mapping
- I/O Port Pins
- EFR32 Pin
- EFR32 Peripheral
- EXP Header
  Connection
- WSTK
  Breakout Pin
- WSTK Peripheral
  Connection
- Serial Flash
- (near RP200) Serial resistors on SPI interface to mitigate any
  signal integrity issues that might arise when an
  unknown load is connected to the expansion header.
- (near X2) Low Frequency Crystal
- (near R217) Overlay
  pads of
  R216/R217
- (in symbol TitleBlock_SiliconLabs_A3) Board Name; Page Title; Designed; Approved; Board Number; Revision; Size; Sheet Modified Date; Sheet; COPYRIGHT SILICON LABORATORIES INC. 2020          CONFIDENTIAL – SUBJECT TO TERMS OF USE; of

### Library data of the parts
*#5 = TitleBlock_SiliconLabs_A3: Page Size: =PageSize; Page Modify Date: =ModifiedDate; OrgName: Silicon Labs
C124 = C0201: Part Reference: C124; Tolerance: 20%; Rating: 16V; Technology: X7S; Value: 100N; PCB Footprint: C0201_L
C207 = C0201: Part Reference: C207; Tolerance: 20%; Rating: 16V; Technology: X7S; Value: 100N; PCB Footprint: C0201_L
R103 = R0201: Part Reference: R103; Price_1K: 0.005; Value: 330K; PCB Footprint: R0201_L
R202-R204 = R0201: Price_1K: 0.005
  R202 R204: Value: 0R
  R203: Value: NM
R216 = R0402: Part Reference: R216; Price_1K: 0.005; Value: 0R; PCB Footprint: R0402_L
R217 = R0402: Part Reference: R217; Price_1K: 0.005; Value: 0R; PCB Footprint: R0402_L
RP200 = MNR04M0APJ101: Part Reference: RP200; Mfg: ROHM; Price_1K: 0.0122; Mfg #: MNR04M0APJ101; Value: 100R; PCB Footprint: RES_MNR04-8
U1 = EFR32xG23_QFN48: as U1 on sheet 02_ RF & Power; Value: EFR32FG28B320F1024IM48; PCB Footprint: QFN48_M040_6.0X6.0_EP_SL
U100 = MX25R8035: Part Reference: U100; Mfg: Macronix; Mfg #: MX25R8035FBDIL0; Price_1K: 0.25; Value: MX25R8035F; PCB Footprint: BGA8_M040_1.24x1.75_WLCSP
X2 = CM8V-T1A: Part Reference: X2; Mfg: Micro Crystal AG; Mfg #: CM8V-T1A-32.768KHZ-7PF-20PPM-TA-QC; Price_1K: 0.3; Value: 32.768 kHz; PCB Footprint: X_MCS_CM8V-T1A

## Sheet 04_ WSTK Connectors & Board ID.SchDoc: EFR32FG28 Diversity Board with discrete matching network for 868/915 MHz
size 420 x 297 mm; Doc: BRD4210C; OrgName: Silicon Labs; Page Number: 4; Page Title: WSTK Connectors & Board ID; Page Size: A3; Page Count: 4; Board Designer: MSZ; RevCode: A00; DsnPath: C:\Users\maszvobo\Downloads\BRD4210A-A01-schematic-dsn\BRD4210A.DSN; SchematicName: SCHEMATIC1; PageName: WSTK Connectors & Board ID; PageSize: A3; TopSchematic: True
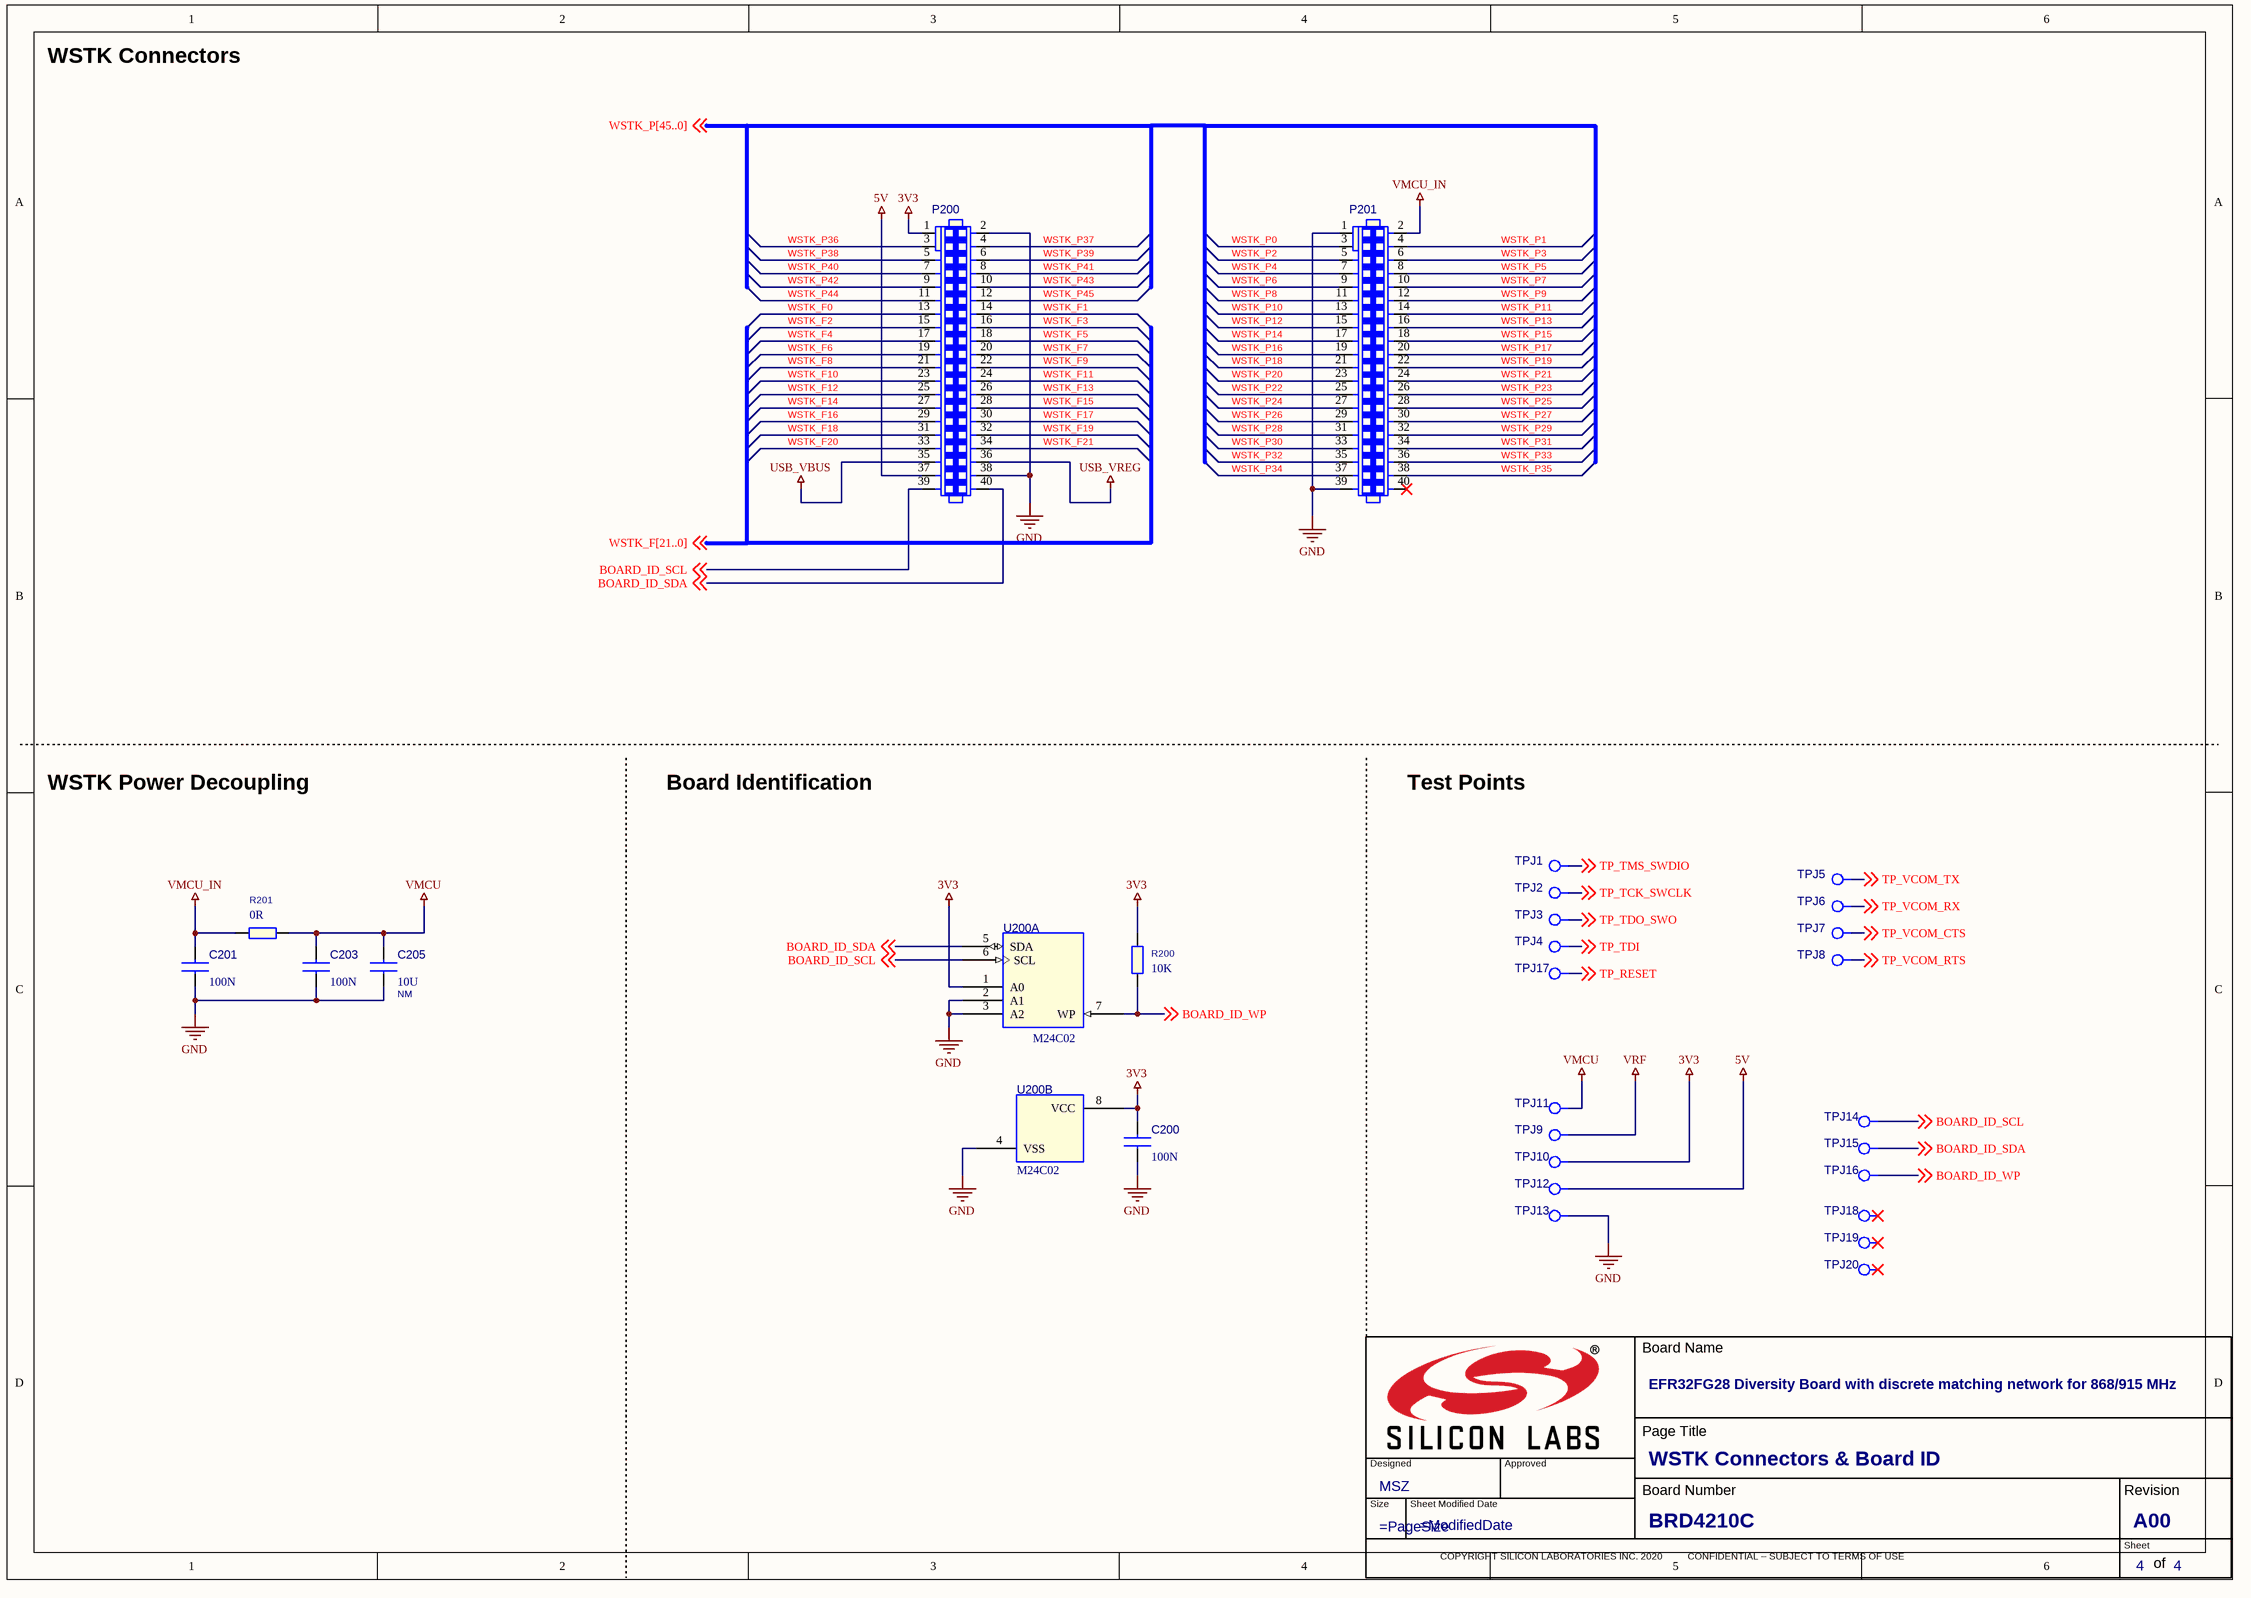
[diagram p4: 04_ WSTK Connectors & Board ID.SchDoc]

### Parts
(Parts that share a designator on the sheet are numbered #1, #2 ... from top to bottom, then left to right.)
*#6  Doc: BRD4210C  RevCode: A00  Board Designer: MSZ  Page Title: WSTK Connectors & Board ID  Page Number: 4  Title: EFR32FG28 Diversity Board with discrete matching network for 868/915 MHz  (graphical)
C200  100N  [C0201_L]
C201  100N  [C0201_L]
C203  100N  [C0201_L]
C205  10U  Not Mounted: NM  [T_UNDEF]
P200  SOCKET_WCON_2X20_1.27MM_SMD  [SAM_SFC-120-T2-D-A-2X20_SNUM]  (value not drawn)
P201  SOCKET_WCON_2X20_1.27MM_SMD  [SAM_SFC-120-T2-D-A-2X20_SNUM]  (value not drawn)
R200  10K  [R0201_L]
R201  0R  [T_UNDEF]
TPJ1  TPJ_SMD  [TP_1.0_SMD]  (value not drawn)
TPJ2  TPJ_SMD  [TP_1.0_SMD]  (value not drawn)
TPJ3  TPJ_SMD  [TP_1.0_SMD]  (value not drawn)
TPJ4  TPJ_SMD  [TP_1.0_SMD]  (value not drawn)
TPJ5  TPJ_SMD  [TP_1.0_SMD]  (value not drawn)
TPJ6  TPJ_SMD  [TP_1.0_SMD]  (value not drawn)
TPJ7  TPJ_SMD  [TP_1.0_SMD]  (value not drawn)
TPJ8  TPJ_SMD  [TP_1.0_SMD]  (value not drawn)
TPJ9  TPJ_SMD  [TP1MM_SMD]  (value not drawn)
TPJ10  TPJ_SMD  [TP1MM_SMD]  (value not drawn)
TPJ11  TPJ_SMD  [TP1MM_SMD]  (value not drawn)
TPJ12  TPJ_SMD  [TP1MM_SMD]  (value not drawn)
TPJ13  TPJ_SMD  [TP1MM_SMD]  (value not drawn)
TPJ14  TPJ_SMD  [TP1MM_SMD]  (value not drawn)
TPJ15  TPJ_SMD  [TP1MM_SMD]  (value not drawn)
TPJ16  TPJ_SMD  [TP1MM_SMD]  (value not drawn)
TPJ17  TPJ_SMD  [TP_1.0_SMD]  (value not drawn)
TPJ18  TPJ_SMD  [TP1MM_SMD]  (value not drawn)
TPJ19  TPJ_SMD  [TP1MM_SMD]  (value not drawn)
TPJ20  TPJ_SMD  [TP1MM_SMD]  (value not drawn)
U200  M24C02  [TDFN8_M050_2.0X3.0_EP]  (parts A,B of 2)

### Nets
3V3: C200.1 P200.1 R200.2 TPJ10.1(TP) U200.1(A0) U200.8(VCC)
5V: P200.37 TPJ12.1(TP)
GND: C200.2 C201.2 C203.2 C205.2 P200.2 P200.38 P201.1 P201.39 TPJ13.1(TP) U200.2(A1) U200.3(A2) U200.4(VSS)
USB_VBUS: P200.35
USB_VREG: P200.36
VMCU: C203.1 C205.1 R201.2 TPJ11.1(TP)
VMCU_IN: C201.1 P201.2 R201.1
VRF: TPJ9.1(TP)
BOARD_ID_SCL: P200.39 TPJ14.1(TP) U200.6(SCL) ; off-sheet BOARD_ID_SCL
BOARD_ID_SDA: P200.40 TPJ15.1(TP) U200.5(SDA) ; off-sheet BOARD_ID_SDA
BOARD_ID_WP: R200.1 TPJ16.1(TP) U200.7(WP) ; off-sheet BOARD_ID_WP
TP_RESET: P200.17 TPJ17.1(TP) ; off-sheet TP_RESET  [also labelled WSTK_F4]  [project net DBG_RESET]
TP_TCK_SWCLK: P200.14 P201.23 TPJ2.1(TP) ; off-sheet TP_TCK_SWCLK  [also labelled WSTK_F1, WSTK_P20]  [project net DBG_SWCLK]
TP_TDI: P200.8 P200.16 P201.17 TPJ4.1(TP) ; off-sheet TP_TDI  [also labelled WSTK_F3, WSTK_P14, WSTK_P41]  [project net DBG_TDI]
TP_TDO_SWO: P200.9 P200.15 P201.19 TPJ3.1(TP) ; off-sheet TP_TDO_SWO  [also labelled WSTK_F2, WSTK_P16, WSTK_P42]  [project net DBG_SWO / DBG_TDO]
TP_TMS_SWDIO: P200.13 P201.21 TPJ1.1(TP) ; off-sheet TP_TMS_SWDIO  [also labelled WSTK_F0, WSTK_P18]  [project net DBG_SWDIOTMS]
TP_VCOM_CTS: P200.21 P201.3 TPJ7.1(TP) ; off-sheet TP_VCOM_CTS  [also labelled WSTK_F8, WSTK_P0]  [project net EFR32_PA10]
TP_VCOM_RTS: P200.22 P201.5 TPJ8.1(TP) ; off-sheet TP_VCOM_RTS  [also labelled WSTK_F9, WSTK_P2]  [project net EFR32_PA0]
TP_VCOM_RX: P200.20 P201.14 TPJ6.1(TP) ; off-sheet TP_VCOM_RX  [also labelled WSTK_F7, WSTK_P11]  [project net EFR32_PA9]
TP_VCOM_TX: P200.19 P201.12 TPJ5.1(TP) ; off-sheet TP_VCOM_TX  [also labelled WSTK_F6, WSTK_P9]  [project net EFR32_PA8]
WSTK_F5: P200.18 P201.18  [also labelled WSTK_P15]  [project net EFR32_PB0]
WSTK_F10: P200.23 P201.22  [also labelled WSTK_P19]  [project net EFR32_PB2]
WSTK_F11: P200.24 P201.29  [also labelled WSTK_P26]  [project net EFR32_PD3]
WSTK_F12: P200.25 P201.20  [also labelled WSTK_P17]  [project net EFR32_PB1]
WSTK_F13: P200.26 P201.24  [also labelled WSTK_P21]  [project net EFR32_PB3]
WSTK_F14: P200.4 P200.27  [also labelled WSTK_P37]  [project net DISP_ENABLE]
WSTK_F15: P200.28 P201.8  [also labelled WSTK_P5]  [project net DISP_SCLK]
WSTK_F16: P200.29 P201.4  [also labelled WSTK_P1]  [project net DISP_SI]
WSTK_F17: P200.30 P201.34  [also labelled WSTK_P31]  [project net DISP_SCS]
WSTK_F18: P200.31 P201.36  [also labelled WSTK_P33]  [project net DISP_EXTCOMIN]
WSTK_F19: P200.32 P201.27  [also labelled WSTK_P24]  [project net EFR32_PD5]
WSTK_F20: P200.33 P201.28  [also labelled WSTK_P25]  [project net EFR32_PD4]
WSTK_F21: P200.34
WSTK_P3: P201.6  [project net EXP_HEADER6]
WSTK_P4: P200.10 P201.7  [also labelled WSTK_P43]  [project net DEBUG_TRACED1]
WSTK_P6: P201.9  [project net EXP_HEADER9]
WSTK_P7: P201.10  [project net EFR32_PC0]
WSTK_P10: P200.12 P201.13  [also labelled WSTK_P45]  [project net DEBUG_TRACED3]
WSTK_P12: P201.15  [project net EFR32_PC5]
WSTK_P13: P201.16  [project net EFR32_PC7]
WSTK_P22: P201.25
WSTK_P23: P201.26
WSTK_P27: P201.30
WSTK_P28: P201.31
WSTK_P29: P201.32
WSTK_P30: P201.33
WSTK_P32: P201.35
WSTK_P34: P201.37
WSTK_P35: P201.38  [project net EFR32_PC4]
WSTK_P36: P200.3  [project net JOYSTICK]
WSTK_P38: P200.5
WSTK_P39: P200.6
WSTK_P40: P200.7
WSTK_P44: P200.11 P201.11  [also labelled WSTK_P8]  [project net DEBUG_TRACED2]

Not connected (* = marked no-connect by the designer): P201 40*; TPJ18 1(TP)*; TPJ19 1(TP)*; TPJ20 1(TP)*

### Notes on the sheet
- WSTK Connectors
- WSTK Power Decoupling
- Board Identification
- Test Points
- (in symbol TitleBlock_SiliconLabs_A3) Board Name; Page Title; Designed; Approved; Board Number; Revision; Size; Sheet Modified Date; Sheet; COPYRIGHT SILICON LABORATORIES INC. 2020          CONFIDENTIAL – SUBJECT TO TERMS OF USE; of

### Library data of the parts
*#6 = TitleBlock_SiliconLabs_A3: Page Size: =PageSize; Page Count: 4; Page Modify Date: =ModifiedDate; OrgName: Silicon Labs
C200 = C0201: Part Reference: C200; Tolerance: 20%; Rating: 16V; Technology: X7S; Value: 100N; PCB Footprint: C0201_L
C201 = C0201: Part Reference: C201; Tolerance: 20%; Rating: 16V; Technology: X7S; Value: 100N; PCB Footprint: C0201_L
C203 = C0201: Part Reference: C203; Tolerance: 20%; Rating: 16V; Technology: X7S; Value: 100N; PCB Footprint: C0201_L
C205 = CAPACITOR: Part Reference: C205; PCB Footprint: C0805_L; Technology: X5R; Value: 10U
P200 = SOCKET_WCON_2X20_1.27MM_SMD: Part Reference: P200; Mfg #: 2344-220MS3CUNR6; Mfg: WCON; Price_1K: 3.44; Value: SOCKET_WCON_2X20_1.27MM_SMD; PCB Footprint: SAM_SFC-120-T2-D-A-2X20_SNUM
P201 = SOCKET_WCON_2X20_1.27MM_SMD: Part Reference: P201; Mfg #: 2344-220MS3CUNR6; Mfg: WCON; Price_1K: 3.44; Value: SOCKET_WCON_2X20_1.27MM_SMD; PCB Footprint: SAM_SFC-120-T2-D-A-2X20_SNUM
R200 = R0201: Part Reference: R200; Price_1K: 0.005; Value: 10K; PCB Footprint: R0201_L
R201 = RESISTOR: Part Reference: R201; PCB Footprint: R0402_L; Price_1K: 0.005; Value: 0R
TPJ1 = TPJ_SMD_Dup1: Part Reference: TPJ1; PCB Footprint: TP_1.0_SMD
TPJ2 = TPJ_SMD_Dup1: Part Reference: TPJ2; PCB Footprint: TP_1.0_SMD
TPJ3 = TPJ_SMD_Dup1: Part Reference: TPJ3; PCB Footprint: TP_1.0_SMD
TPJ4 = TPJ_SMD_Dup1: Part Reference: TPJ4; PCB Footprint: TP_1.0_SMD
TPJ5 = TPJ_SMD_Dup1: Part Reference: TPJ5; PCB Footprint: TP_1.0_SMD
TPJ6 = TPJ_SMD_Dup1: Part Reference: TPJ6; PCB Footprint: TP_1.0_SMD
TPJ7 = TPJ_SMD_Dup1: Part Reference: TPJ7; PCB Footprint: TP_1.0_SMD
TPJ8 = TPJ_SMD_Dup1: Part Reference: TPJ8; PCB Footprint: TP_1.0_SMD
TPJ9 = TPJ_SMD: Part Reference: TPJ9; PCB Footprint: TP_1.0_SMD
TPJ10 = TPJ_SMD: Part Reference: TPJ10; PCB Footprint: TP_1.0_SMD
TPJ11 = TPJ_SMD: Part Reference: TPJ11; PCB Footprint: TP_1.0_SMD
TPJ12 = TPJ_SMD: Part Reference: TPJ12; PCB Footprint: TP_1.0_SMD
TPJ13 = TPJ_SMD: Part Reference: TPJ13; PCB Footprint: TP_1.0_SMD
TPJ14 = TPJ_SMD: Part Reference: TPJ14; PCB Footprint: TP_1.0_SMD
TPJ15 = TPJ_SMD: Part Reference: TPJ15; PCB Footprint: TP_1.0_SMD
TPJ16 = TPJ_SMD: Part Reference: TPJ16; PCB Footprint: TP_1.0_SMD
TPJ17 = TPJ_SMD_Dup1: Part Reference: TPJ17; PCB Footprint: TP_1.0_SMD
TPJ18 = TPJ_SMD: Part Reference: TPJ18; PCB Footprint: TP_1.0_SMD
TPJ19 = TPJ_SMD: Part Reference: TPJ19; PCB Footprint: TP_1.0_SMD
TPJ20 = TPJ_SMD: Part Reference: TPJ20; PCB Footprint: TP_1.0_SMD
U200 = M24C02: Part Reference: U200; Mfg #: M24C02-FMC6TG; Mfg: ST Microelectronics; CONTEC Footprint: MSOP8_M065_W3.0; Price_1K: 0.06; Value: M24C02; PCB Footprint: TDFN8_M050_2.0X3.0_EP

## Nets that join several sheets
GND: 02_ RF & Power (44 pins), 03_ EFR32 Signal Assignments (C124.2 C207.2 U100.B2), 04_ WSTK Connectors & Board ID (12 pins)
VMCU: 02_ RF & Power (10 pins), 03_ EFR32 Signal Assignments (5 pins), 04_ WSTK Connectors & Board ID (C203.1 C205.1 R201.2 TPJ11.1)
DBG_RESET: 02_ RF & Power (U1.13), 03_ EFR32 Signal Assignments (C207.1), 04_ WSTK Connectors & Board ID (P200.17 TPJ17.1)
DBG_SWCLK: 03_ EFR32 Signal Assignments (U1.26), 04_ WSTK Connectors & Board ID (P200.14 P201.23 TPJ2.1)
DBG_SWDIOTMS: 03_ EFR32 Signal Assignments (U1.27), 04_ WSTK Connectors & Board ID (P200.13 P201.21 TPJ1.1)
DBG_SWO / DBG_TDO: 03_ EFR32 Signal Assignments (U1.28), 04_ WSTK Connectors & Board ID (P200.9 P200.15 P201.19 TPJ3.1)
DBG_TDI: 03_ EFR32 Signal Assignments (U1.29), 04_ WSTK Connectors & Board ID (P200.8 P200.16 P201.17 TPJ4.1)
DEBUG_TRACED1: 03_ EFR32 Signal Assignments (U1.30), 04_ WSTK Connectors & Board ID (P200.10 P201.7)
DEBUG_TRACED2: 03_ EFR32 Signal Assignments (U1.31), 04_ WSTK Connectors & Board ID (P200.11 P201.11)
DEBUG_TRACED3: 03_ EFR32 Signal Assignments (U1.32), 04_ WSTK Connectors & Board ID (P200.12 P201.13)
DISP_ENABLE: 03_ EFR32 Signal Assignments (U1.10), 04_ WSTK Connectors & Board ID (P200.4 P200.27)
DISP_EXTCOMIN: 03_ EFR32 Signal Assignments (U1.7), 04_ WSTK Connectors & Board ID (P200.31 P201.36)
DISP_SCLK: 03_ EFR32 Signal Assignments (RP200.6), 04_ WSTK Connectors & Board ID (P200.28 P201.8)
DISP_SCS: 03_ EFR32 Signal Assignments (R204.1), 04_ WSTK Connectors & Board ID (P200.30 P201.34)
DISP_SI: 03_ EFR32 Signal Assignments (RP200.8), 04_ WSTK Connectors & Board ID (P200.29 P201.4)
EFR32_PA0: 03_ EFR32 Signal Assignments (U1.25), 04_ WSTK Connectors & Board ID (P200.22 P201.5 TPJ8.1)
EFR32_PA8: 03_ EFR32 Signal Assignments (U1.33), 04_ WSTK Connectors & Board ID (P200.19 P201.12 TPJ5.1)
EFR32_PA9: 03_ EFR32 Signal Assignments (U1.34), 04_ WSTK Connectors & Board ID (P200.20 P201.14 TPJ6.1)
EFR32_PA10: 03_ EFR32 Signal Assignments (U1.35), 04_ WSTK Connectors & Board ID (P200.21 P201.3 TPJ7.1)
EFR32_PB0: 03_ EFR32 Signal Assignments (U1.24), 04_ WSTK Connectors & Board ID (P200.18 P201.18)
EFR32_PB1: 03_ EFR32 Signal Assignments (U1.23), 04_ WSTK Connectors & Board ID (P200.25 P201.20)
EFR32_PB2: 03_ EFR32 Signal Assignments (U1.22), 04_ WSTK Connectors & Board ID (P200.23 P201.22)
EFR32_PB3: 02_ RF & Power (C6.2 U3.5), 03_ EFR32 Signal Assignments (U1.21), 04_ WSTK Connectors & Board ID (P200.26 P201.24)
EFR32_PC0: 03_ EFR32 Signal Assignments (U1.1), 04_ WSTK Connectors & Board ID (P201.10)
EFR32_PC4: 03_ EFR32 Signal Assignments (R103.1 U1.5 U100.A3), 04_ WSTK Connectors & Board ID (P201.38)
EFR32_PC5: 03_ EFR32 Signal Assignments (U1.6), 04_ WSTK Connectors & Board ID (P201.15)
EFR32_PC7: 03_ EFR32 Signal Assignments (U1.8), 04_ WSTK Connectors & Board ID (P201.16)
EFR32_PD3: 02_ RF & Power (C2.2 U3.2), 03_ EFR32 Signal Assignments (U1.45), 04_ WSTK Connectors & Board ID (P200.24 P201.29)
EFR32_PD4: 03_ EFR32 Signal Assignments (U1.44), 04_ WSTK Connectors & Board ID (P200.33 P201.28)
EFR32_PD5: 03_ EFR32 Signal Assignments (U1.43), 04_ WSTK Connectors & Board ID (P200.32 P201.27)
EXP_HEADER6: 03_ EFR32 Signal Assignments (RP200.7), 04_ WSTK Connectors & Board ID (P201.6)
EXP_HEADER9: 03_ EFR32 Signal Assignments (R216.2), 04_ WSTK Connectors & Board ID (P201.9)
JOYSTICK: 03_ EFR32 Signal Assignments (R217.2), 04_ WSTK Connectors & Board ID (P200.3)
TCXO_supply: 02_ RF & Power (R108.1), 03_ EFR32 Signal Assignments (R202.1 R203.1)